# Altium schematic sheet Others.SchDoc
size A4
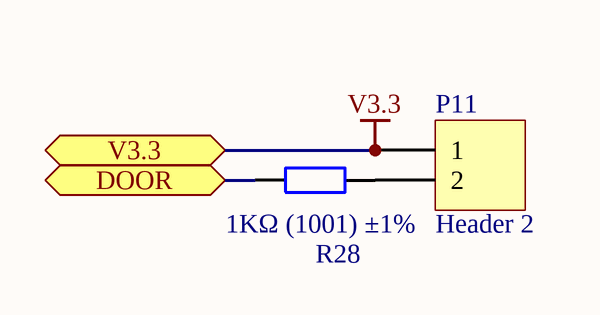
[diagram p0: Others.SchDoc]

## Parts
P11  Header 2  [2P_XH2.54]
R28  1KΩ (1001) ±1%  [0805_R]

## Ports
DOOR, V3.3

## Nets
V3.3: P11.1 ; port V3.3
DOOR: R28.1 ; port DOOR
NetP11_2: P11.2 R28.2

## Library data of the parts
P11 = Header 2: Header, 2-Pin; LatestRevisionDate: 17-Jul-2002; LatestRevisionNote: Re-released for DXP Platform.; Publisher: Altium Limited
R28 = 0805 1KΩ (1001) 1%: 贴片电阻; ComponentLink1Description: 供应商链接; ComponentLink1URL: http://www.szlcsc.com/product/details_18201.html; Package: 0805; Supplier: LC; SuppliersPartNumber: C17513